# EasyEDA Pro project avaruusantenni_tallylight.eprj, board RF-Frontend
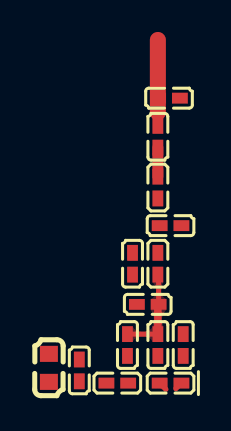
[diagram p12: board, top side]
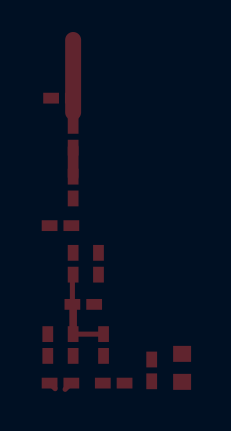
[diagram p13: board, bottom side, seen from below]

No outline. copper layers: Top Layer, Bottom Layer. Coordinates in mm from the lowest, leftmost part position.
Stack: Top Layer 0.035mm / Dielectric1 1.51mm FR4 er 4.5 / Bottom Layer 0.035mm

## Design rules (mm)
template: Custom Config
spacing copperThickness1oz (default): track to track 0.102, other pairs 0.152 to 0.3
spacing copperThickness2oz: track to track 0.203, other pairs 0.152 to 0.3
track width copperThickness1oz (default): min 0.127, default 0.254, max 2.54
track width copperThickness2oz: min 0.203, default 0.254, max 2.54
differential pair differentialPair (default): width min 0.127, default 0.254, max 2.54; gap min 0.152, default 0.152
via viaSize (default): diameter min 0.5, default 0.61, max 10; hole min 0.3, default 0.305, max 6.3
net $3N1088 uses trace pour
net $3N1085 uses trace pour
net RFO_HP uses trace pour
net RFI_N uses trace pour
net VR_PA uses trace pour
net RFI_P uses trace pour

## Placement (name value [footprint] x y rotation side)
C3  47nF  [C0603]  0 0.76 270 top
C4  47pF  [C0402]  1.52 0.63 270 top
C5  2.2pF  [C0402]  4.19 5.97 90 top
C6  33pF  [C0402]  3.94 1.91 90 top
C7  33pF  [C0402]  5.46 12.32 90 top
C8  0.7pF  [C0402]  4.95 3.94 0 top
C9  7.5pF  [C0402]  6.1 7.87 180 top
C10  4.7pF  [C0402]  5.46 1.91 270 top
C11  2.2pF  [C0402]  6.02 14.25 180 top
C12  4.7pF  [C0402]  6.73 1.91 270 top
L1  47nH  [L0402]  3.43 0 180 top
L2  3.3nH  [L0402]  5.46 5.97 90 top
L3  8.2nH  [L0402]  5.46 9.78 90 top
L4  9.1nH  [L0402-RD]  6.1 0 180 top

## Footprints (pads in the part's own frame, mm; a bottom-side part is the same pattern mirrored in y, then rotated)
C0402
  rect 0.79x0.54 smd: 1(-0.545,0) 2(0.545,0)
C0603
  rect 0.8x0.9 smd: 1(-0.7,0) 2(0.7,0)
L0402
  rect 0.79x0.54 smd: 1(-0.545,0) 2(0.545,0)
L0402-RD
  rect 0.79x0.54 smd: 1(-0.545,0) 2(0.545,0)

## Nets
As in the schematic, except:
$3N1094: C7.2 C11.2

## Routing (per net, layer and track width the routed paths; a pad name or vN(x,y) marks a point on that pad's centre or on a via; arc(x,y) is an arc through that point)
RFI_N: length 0.4
  Top Layer w0.254: 5.86,-0.31 5.55,0
RFI_P: length 0.4
  Top Layer w0.254: 6.36,-0.28 L4.1
$3N1085: length 4.5
  Top Layer w0.254: L2.1 5.5,5.39 C8.2 ; C6.2 C10.1
  Top Layer w0.381: C10.1 5.46,3.9 C8.2
$3N1091: length 1.5
  Top Layer w0.54: L3.2 C7.1
$3N1094: length 3.6
  Top Layer w0.8: 5.46,13.54 5.46,17.16

## Copper pours and planes (outline as drawn; the poured copper is in the pictures)
RFO_HP on Top Layer: 4.39,-0.33 4.39,0.33 4.19,1.3 3.68,1.3 3.53,0.28 3.53,-0.28 4.65,-1.3 4.75,-1.55 4.95,-1.55 5,-1.45 5,-1.04
VR_PA on Top Layer: -0.51,0.51 3.3,0.51 3.3,-0.38 4.19,-1.27 4.34,-1.35 4.36,-2.24 4.14,-2.23 2.29,-0.38 -0.51,-0.38
$3N1085 on Top Layer: 3.89,5.87 5.77,5.87 5.77,5 3.89,5
$3N1088 on Top Layer: 3.89,6.93 5.77,6.93 5.77,6.07 3.89,6.07
$3N1088 on Top Layer: 5.21,9.02 5.11,8.15 5.11,6.68 5.72,6.68 5.97,7.59 5.97,8.15 5.72,9.02

Small or netless copper shapes (teardrops, artwork), in the pictures only: 11 on Top Layer
